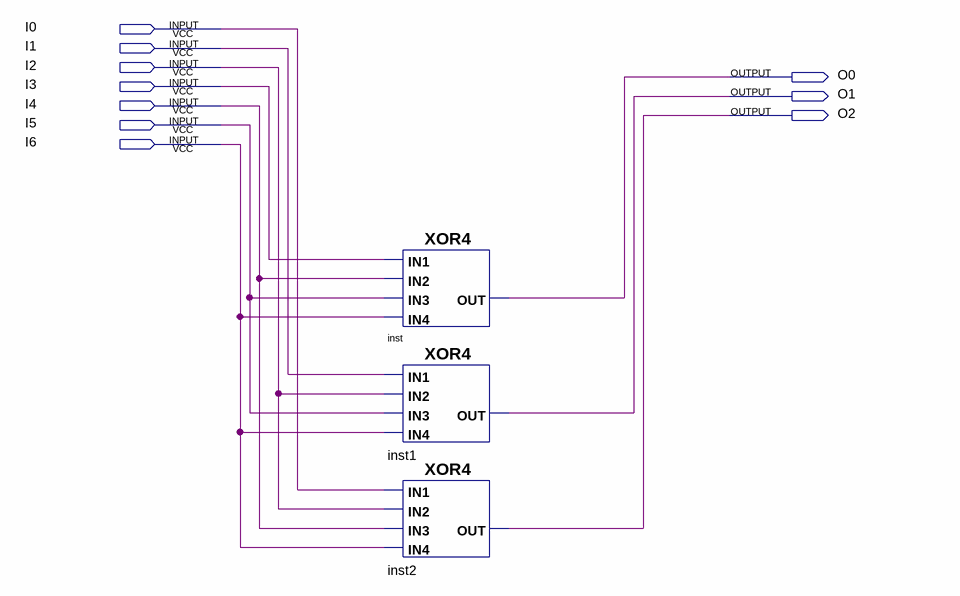
[diagram p0: schematic sheet]
// Quartus schematic syndrome.bdf as structural Verilog: 3 symbols, 10 pins
module syndrome (
  input  I0,
  input  I1,
  input  I2,
  input  I3,
  input  I4,
  input  I5,
  input  I6,
  output O0,
  output O1,
  output O2
);

  XOR4 inst (.IN3(I5), .IN4(I6), .IN2(I4), .IN1(I3), .OUT(O0));
  XOR4 inst1 (.IN3(I5), .IN4(I6), .IN2(I2), .IN1(I1), .OUT(O1));
  XOR4 inst2 (.IN3(I4), .IN4(I6), .IN2(I2), .IN1(I0), .OUT(O2));
endmodule
